# EAGLE design pwr_supply_controller (EAGLE 7.2.0)
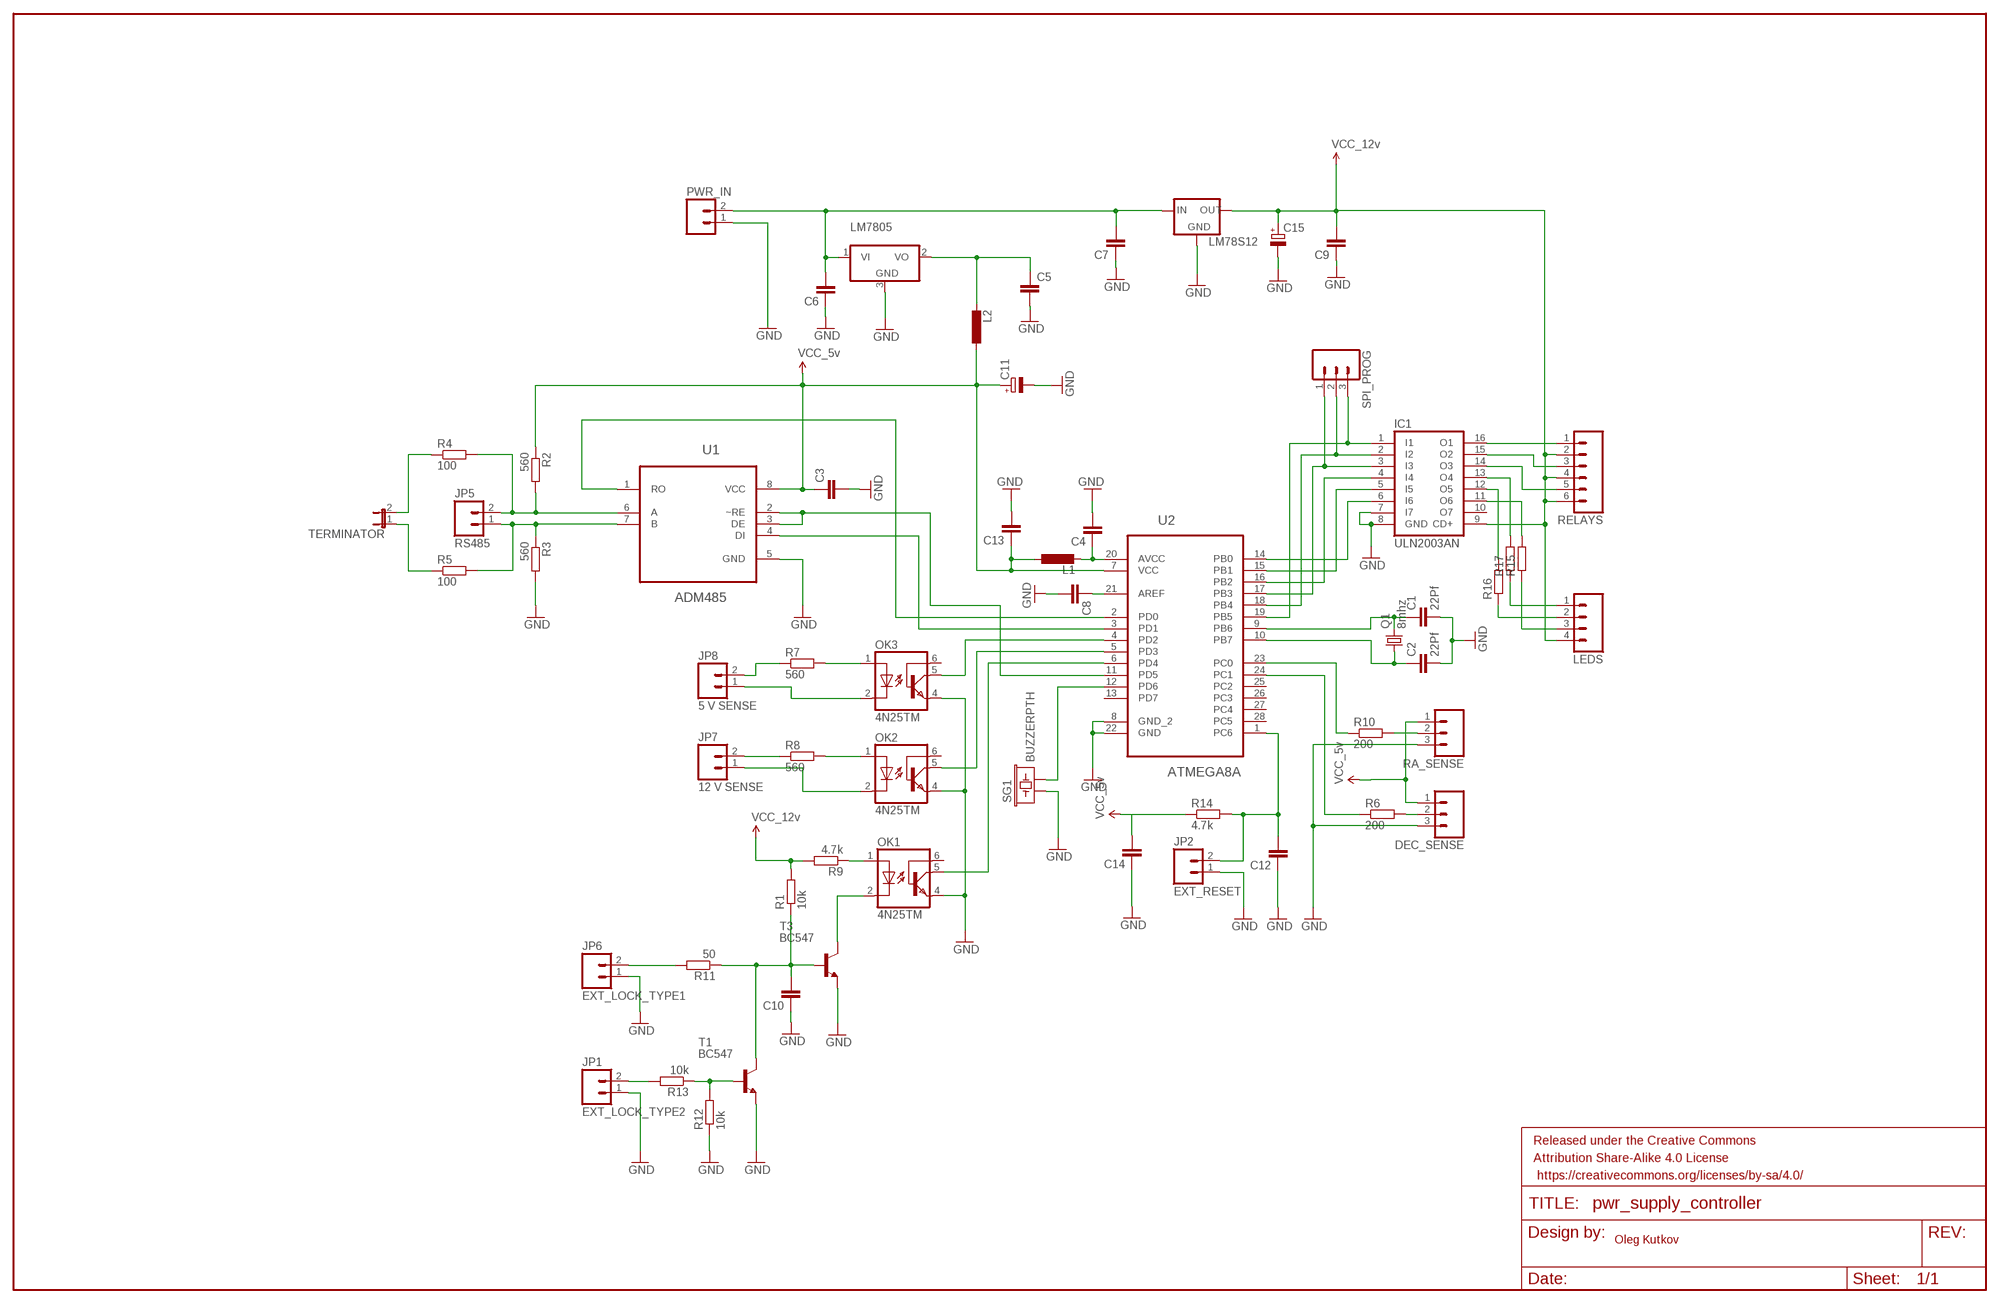
[diagram p0: schematic, sheet 1]

## Parts
C1  22Pf  C-EUC0603K  [C0603K]
C2  22Pf  C-EUC0603K  [C0603K]
C3  C-EUC0603K  [C0603K]
C4  C-EUC0603K  [C0603K]
C5  C-EUC0603K  [C0603K]
C6  C-EUC0805  [C0805]
C7  C-EUC0805  [C0805]
C8  C-EUC0603K  [C0603K]
C9  C-EUC0805  [C0805]
C10  C-EUC0603K  [C0603K]
C11  CPOL-EUE2-5  [E2-5]
C12  C-EUC0603K  [C0603K]
C13  C-EUC0603K  [C0603K]
C14  C-EUC0603K  [C0603K]
C15  CPOL-EUE3.5-8  [E3,5-8]
DEC_SENSE  M03PTH  [1X03]
FRAME1  FRAME-LEDGER  [CREATIVE_COMMONS]
IC1  ULN2003AN  [DIL16]
JP1  EXT_LOCK_TYPE2  M02JST-PTH-VERT  [JST-2-PTH-VERT]
JP2  EXT_RESET  M02PTH  [1X02]
JP5  RS485  M02JST-PTH-VERT  [JST-2-PTH-VERT]
JP6  EXT_LOCK_TYPE1  M02JST-PTH-VERT  [JST-2-PTH-VERT]
JP7  12 V SENSE  M02JST-PTH-VERT  [JST-2-PTH-VERT]
JP8  5 V SENSE  M02JST-PTH-VERT  [JST-2-PTH-VERT]
L1  L-EU0204/7  [0204/7]
L2  L-EU0204/7  [0204/7]
LEDS  M04PTH  [1X04]
LM78S12  V_REG_78XX-TO-220  [TO-220-ALT]
LM7805  7808DT  [TO252]
OK1  4N25TM  [DIL6-04]
OK2  4N25TM  [DIL6-04]
OK3  4N25TM  [DIL6-04]
PWR_IN  M02JST-PTH-VERT  [JST-2-PTH-VERT]
Q1  8mhz  CRYSTALHC49S  [HC49/S]
R1  10k  R-EU_0204/7  [0204/7]
R2  560  R-EU_M0805  [M0805]
R3  560  R-EU_M0805  [M0805]
R4  100  R-EU_R0805  [R0805]
R5  100  R-EU_M0805  [M0805]
R6  200  R-EU_M0805  [M0805]
R7  560  R-EU_0204/7  [0204/7]
R8  560  R-EU_0204/7  [0204/7]
R9  4.7k  R-EU_0204/7  [0204/7]
R10  200  R-EU_M0805  [M0805]
R11  50  R-EU_0204/7  [0204/7]
R12  10k  R-EU_0204/7  [0204/7]
R13  10k  R-EU_0204/7  [0204/7]
R14  4.7k  R-EU_M0805  [M0805]
R15  R-EU_M0805  [M0805]
R16  R-EU_M0805  [M0805]
R17  R-EU_M0805  [M0805]
RA_SENSE  M03PTH  [1X03]
RELAYS  M06POLAR  [MOLEX-1X6]
SG1  BUZZERPTH  [BUZZER-12MM]
SPI_PROG  M03PTH  [1X03]
T1  BC547  [TO92]
T3  BC547  [TO92]
TERMINATOR  JUMPER-2PTH_LOCK  [1X02_LOCK]
U1  ADM485  MAX487ECSA+  [SOIC127P600X175-8N]
U2  ATMEGA8A  ATMEGA48A-PU  [DIP254P762X457-28]

## Nets
GND: C1.2 C2.2 C3.2 C4.2 C5.2 C6.1 C7.1 C8.2 C9.1 C10.1 C11.- C12.1 C13.2 C14.1 C15.- DEC_SENSE.3 IC1.7(I7) IC1.8(GND) JP1.1 JP2.1 JP6.1 LM78S12.GND LM7805.3(GND) OK1.4(EMI) OK2.4(EMI) OK3.4(EMI) PWR_IN.1 R3.2 R12.1 RA_SENSE.3 SG1.+ T1.1(E) T3.1(E) U1.5(GND) U2.8(GND_2) U2.22(GND)
N$1: C1.1 Q1.2 U2.9(PB6)
N$2: C2.1 Q1.1 U2.10(PB7)
N$3: OK3.5(COL) U2.4(PD2)
N$4: OK2.5(COL) U2.5(PD3)
N$5: OK3.1(A) R7.2
N$6: OK1.5(COL) U2.6(PD4)
N$7: C4.1 L1.2 U2.20(AVCC)
N$8: R10.2 RA_SENSE.2
N$9: U1.1(RO) U2.2(PD0)
N$10: C8.1 U2.21(AREF)
N$11: U1.4(DI) U2.3(PD1)
N$12: U1.2(~RE) U1.3(DE) U2.11(PD5)
N$13: JP5.2 R2.2 R4.2 U1.6(A)
N$14: JP5.1 R3.1 R5.2 U1.7(B)
N$15: R4.1 TERMINATOR.2
N$16: R5.1 TERMINATOR.1
N$17: C6.2 C7.2 LM78S12.IN LM7805.1(VI) PWR_IN.2
N$18: DEC_SENSE.2 R6.2
N$19: IC1.6(I6) U2.14(PB0)
N$20: IC1.5(I5) U2.15(PB1)
N$21: IC1.4(I4) U2.16(PB2)
N$22: IC1.3(I3) SPI_PROG.1 U2.17(PB3)
N$23: IC1.2(I2) SPI_PROG.2 U2.18(PB4)
N$24: IC1.1(I1) SPI_PROG.3 U2.19(PB5)
N$25: R10.1 U2.23(PC0)
N$26: R6.1 U2.24(PC1)
N$27: IC1.16(O1) RELAYS.1
N$28: IC1.15(O2) RELAYS.3
N$29: IC1.14(O3) RELAYS.5
N$30: JP6.2 R11.2
N$31: LEDS.1 R17.1
N$32: LEDS.2 R16.1
N$33: IC1.11(O6) R15.2
N$34: SG1.- U2.12(PD6)
N$35: JP8.2 R7.1
N$36: JP8.1 OK3.2(C)
N$37: OK2.1(A) R8.2
N$38: JP7.2 R8.1
N$39: JP7.1 OK2.2(C)
N$40: C10.2 R1.1 R11.1 T1.3(C) T3.2(B)
N$41: R12.2 R13.1 T1.2(B)
N$42: OK1.1(A) R9.1
N$43: C5.1 L2.2 LM7805.2(VO)
N$44: OK1.2(C) T3.3(C)
N$45: JP1.2 R13.2
N$46: C12.2 JP2.2 R14.2 U2.1(PC6)
N$47: IC1.12(O5) R16.2
N$49: IC1.13(O4) R17.2
N$50: LEDS.3 R15.1
VCC: C3.1 C11.+ C13.1 C14.2 DEC_SENSE.1 L1.1 L2.1 R2.1 R14.1 RA_SENSE.1 U1.8(VCC) U2.7(VCC) ; supply symbol labelled VCC_5v
VDD: C9.2 C15.+ IC1.9(CD+) LEDS.4 LM78S12.OUT R1.2 R9.2 RELAYS.2 RELAYS.4 RELAYS.6 ; supply symbol labelled VCC_12v
Unconnected: IC1.10(O7) OK1.6(BAS) OK2.6(BAS) OK3.6(BAS) U2.13(PD7) U2.25(PC2) U2.26(PC3) U2.27(PC4) U2.28(PC5)

## Notes on the sheet
- Oleg Kutkov

## Library data of the parts
C1-C10 C12-C14 = rcl:C-EU: CAPACITOR, European symbol
C11 C15 = resistor:CPOL-EU: POLARIZED CAPACITOR, European symbol
DEC_SENSE RA_SENSE SPI_PROG = SparkFun-Connectors:M03: Header 3 Standard 3-pin 0.1" header. Use with straight break away headers (SKU : PRT-00116), right angle break away headers (PRT-00553), swiss pins (PRT-00743), machine pins (PRT-00117), and female headers (PRT-00115). Molex polarized connector foot print use with SKU : PRT-08232 with associated crimp pins and housings.
FRAME1 = SparkFun-Aesthetics:FRAME-LEDGER: Schematic Frame Standard 11x14 US Ledger frame
IC1 = uln-udn:ULN2003A: DRIVER ARRAY
JP1 JP2 JP5-JP8 PWR_IN = SparkFun-Connectors:M02: Standard 2-pin 0.1" header. Use with - straight break away headers ( PRT-00116) - right angle break away headers (PRT-00553) - swiss pins (PRT-00743) - machine pins (PRT-00117) - female headers (PRT-00115) Molex polarized connector foot print use with: PRT-08233 with associated crimp pins and housings. 2.54_SCREWTERM for use with PRT-10571. 3.5mm Screw Terminal footprints for PRT-08084 5mm Screw Terminal footprints for use with PRT-08433
L1 L2 = rcl:L-EU: INDUCTOR, European symbol
LEDS = SparkFun-Connectors:M04: Header 4 Standard 4-pin 0.1" header. Use with straight break away headers (SKU : PRT-00116), right angle break away headers (PRT-00553), swiss pins (PRT-00743), machine pins (PRT-00117), and female headers (PRT-00115). Molex polarized connector foot print use with SKU : PRT-08231 with associated crimp pins and housings. 1MM SMD Version SKU: PRT-10208
LM78S12 = SparkFun-PowerIC:V_REG_78XX: Voltage Regulator Standard 7805 5V regulator. IGO (Input Ground Output). Spark Fun Electronics SKU : COM-00107
LM7805 = linear:78*: Positive VOLTAGE REGULATOR Source: http://cache.national.com/ds/LM/LM78L05.pdf http://www.fairchildsemi.com/ds/LM/LM7805.pdf
OK1-OK3 = optocoupler:4N*?M: General Purpose 6-Pin Phototransistor Optocouplers Source: http://www.fairchildsemi.com/ds/4N/4N35-M.pdf; OC_FARNELL: unknown; OC_NEWARK: unknown
Q1 = adafruit:CRYSTAL: CRYSTAL; OC_FARNELL: 1667008; OC_NEWARK: unknown
R1-R14 = resistor:R-EU_: RESISTOR, European symbol
R15-R17 = rcl:R-EU_: RESISTOR, European symbol
RELAYS = SparkFun-Connectors:M06: Header 6 Standard 6-pin 0.1" header. Use with straight break away headers (SKU : PRT-00116), right angle break away headers (PRT-00553), swiss pins (PRT-00743), machine pins (PRT-00117), and female headers (PRT-00115). Molex polarized connector foot print use with SKU : PRT-08094 with associated crimp pins and housings. NOTES ON THE VARIANTS LOCK and LOCK_LONGPADS... This footprint was designed to help hold the alignment of a through-hole component (i.e. 6-pin header) while soldering it into place. You may notice that each hole has been shifted either up or down by 0.005 of an inch from it's more standard position (which is a perfectly straight line). This slight alteration caused the pins (the squares in the middle) to touch the edges of the holes. Because they are alternating, it causes a "brace" to hold the component in place. 0.005 has proven to be the perfect amount of "off-center" position when using our standard breakaway headers. Although looks a little odd when you look at the bare footprint, once you have a header in there, the alteration is very hard to notice. Also,if you push a header all the way into place, it is covered up entirely on the bottom side. This idea of altering the position of holes to aid alignment will be further integrated into the Sparkfun Library for other footprints. It can help hold any component with 3 or more connection pins.
SG1 = SparkFun-Electromechanical:BUZZER: Buzzer 12mm Spark Fun Electronics SKU : Comp-Buzzer
T1 T3 = transistor:BC547: NPN TRANSISTOR
TERMINATOR = SparkFun-Passives:JUMPER-2: Jumper Basic 0.1" spaced jumper. Use with breakaway headers.
U1 = Maxim_By_element14_Batch_1:MAX487ECSA+: Low-Power, Slew-Rate-Limited RS-485/RS-422 Transceivers; MPN: MAX487ECSA+; OC_FARNELL: 9724532; OC_NEWARK: 68K4803; PACKAGE: SOIC-8; SUPPLIER: Maxim
U2 = Atmel_By_element14_Batch_1-00:ATMEGA48A-PU: MCU; DESCRIPTION: MCU; MPN: ATMEGA48A-PU; OC_FARNELL: 1841613; OC_NEWARK: 12T1302; PACKAGE: DIP-28; SUPPLIER: Atmel

## Board
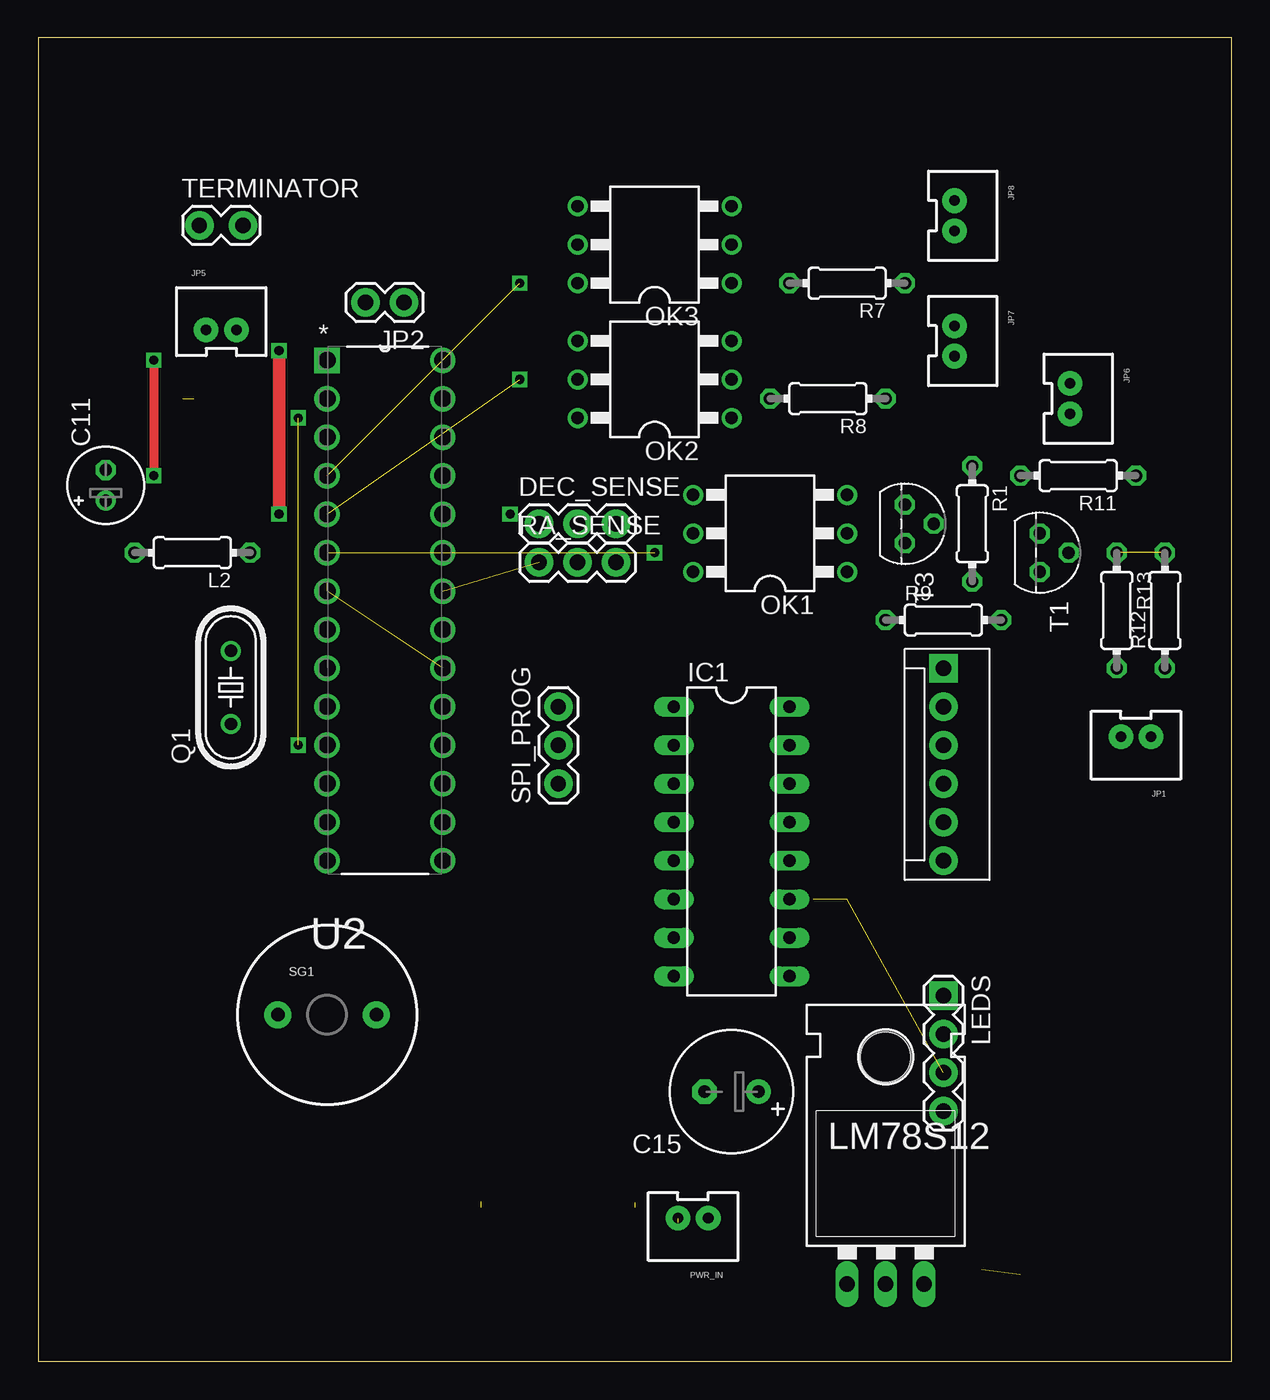
[diagram p1: board, top side]
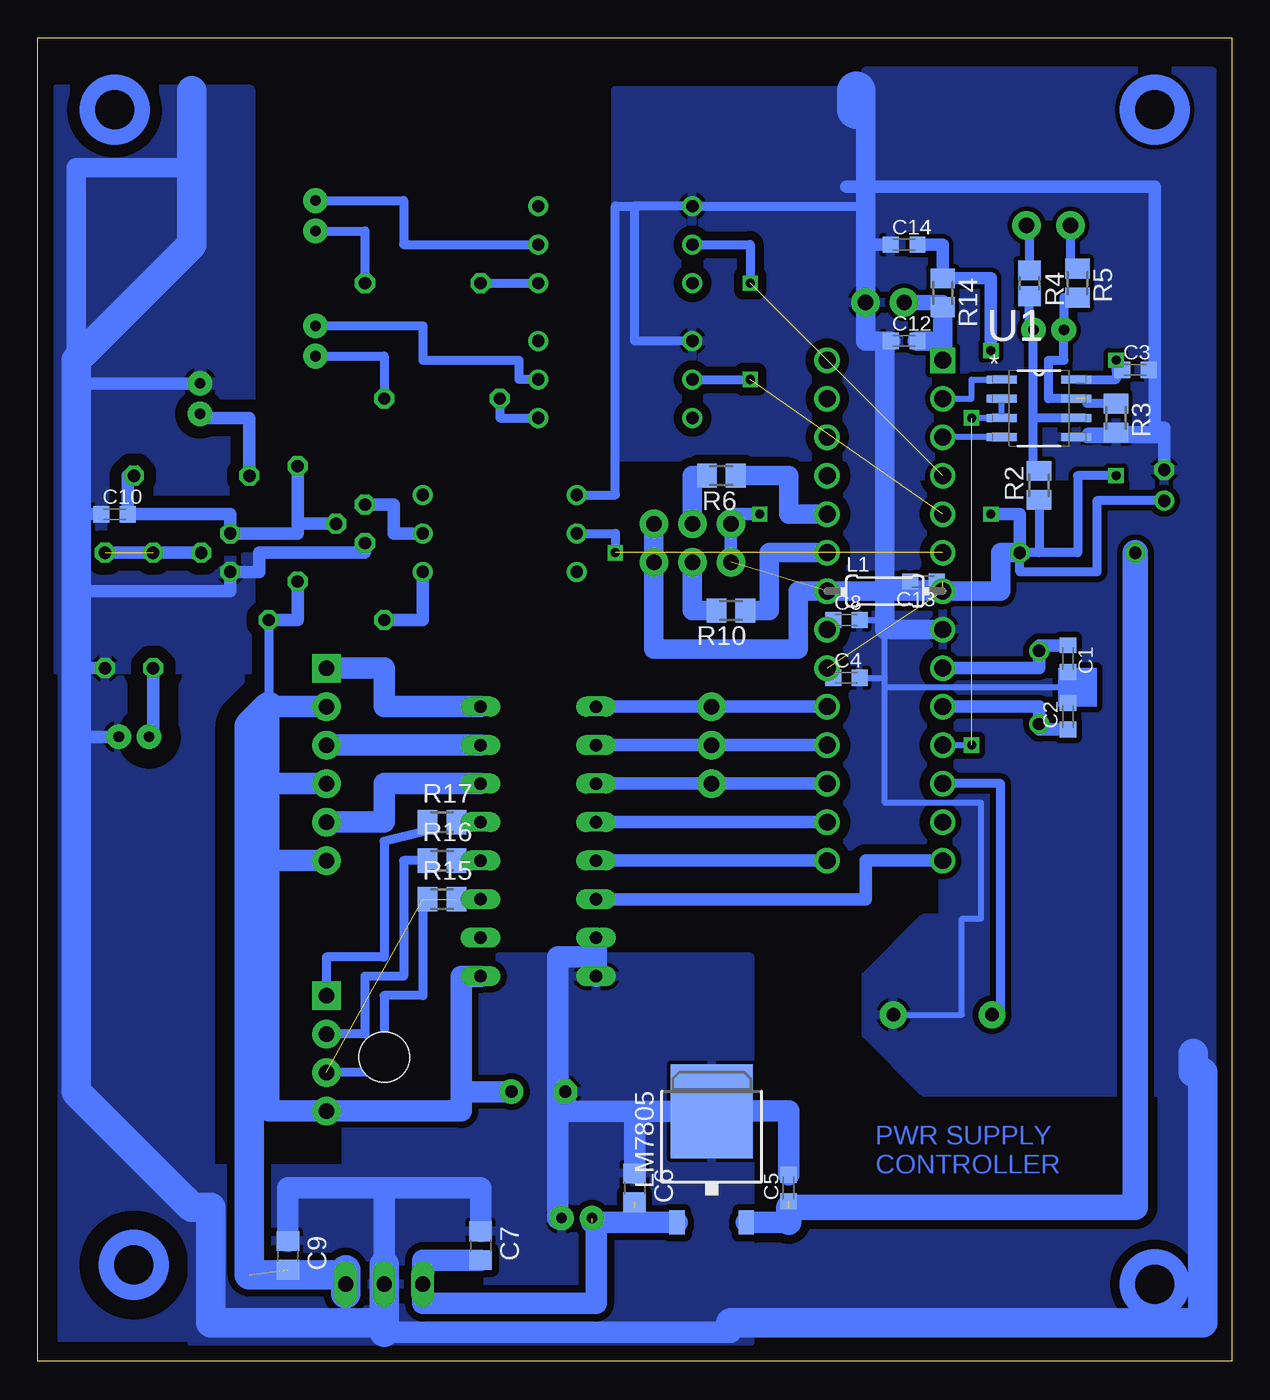
[diagram p2: board, bottom side, seen from below]

Size 78.72 x 87.3 mm. Coordinates in mm from the lower left corner, seen from the top.
Outline: 0,0 78.72,0 78.72,87.3 0,87.3 0,0
Copper layers (1*16): Top 0.035mm / dielectric 1.5mm / Bottom 0.035mm
Design rules "default": minimum track width 10mil, minimum drill 24mil, track to track 8mil, track to pad 8mil, pad to pad 8mil, via to via 8mil, smd to smd 8mil, copper to edge 40mil, drill to drill 8mil, minimum pad ring 10mil, minimum via ring 8mil, stop-mask expansion 4mil, vias tented up to drill 0mil, thermal gap 10mil

### Footprints (pad centres in the part's own frame; a part is rotated, then mirrored left to right if it is on the bottom)
C0603K = smd 1.05 x 1.08: 1 -0.875,0; 2 0.875,0
C0805 = smd 1.3 x 1.5: 1 -0.95,0; 2 0.95,0
E2-5 = drill 0.813 pad 1.27: + -1.016,0 | drill 0.813 pad 1.27 octagon: - 1.016,0
E3,5-8 = drill 0.813 pad 1.6: + -1.778,0 | drill 0.813 pad 1.6 octagon: - 1.778,0
1X03 = drill 1.016 pad 1.88: 1 0,0; 2 2.54,0; 3 5.08,0
DIL16 = drill 0.813 long: 1 -8.89,-3.81; 2 -6.35,-3.81; 3 -3.81,-3.81; 4 -1.27,-3.81; 5 1.27,-3.81; 6 3.81,-3.81; 7 6.35,-3.81; 8 8.89,-3.81; 9 8.89,3.81; 10 6.35,3.81; 11 3.81,3.81; 12 1.27,3.81; 13 -1.27,3.81; 14 -3.81,3.81; 15 -6.35,3.81; 16 -8.89,3.81
JST-2-PTH-VERT = drill 0.7 pad 1.626: 1 -1,-0.55; 2 1,-0.55
1X02 = drill 1.016 pad 1.88: 1 0,0; 2 2.54,0
0204/7 = drill 0.813 octagon: 1 -3.81,0; 2 3.81,0
1X04 = drill 1.016 pad 1.88 square: 1 0,0 | drill 1.016 pad 1.88: 2 2.54,0; 3 5.08,0; 4 7.62,0
TO-220-ALT = drill 1.016 long: GND 0,-3.81; IN -2.54,-3.81; OUT 2.54,-3.81 | hole 3.302: 0,11.176
TO252 = smd 1 x 1.6: 1 -2.28,-4.8; 2 2.28,-4.8 | smd 5.4 x 6.2: 3 0,2.5
DIL6-04 = drill 0.813: 1 -2.54,-5.08; 2 0,-5.08; 3 2.54,-5.08; 4 2.54,5.08; 5 0,5.08; 6 -2.54,5.08
HC49/S = drill 0.813: 1 -2.413,0; 2 2.413,0
M0805 = smd 1.3 x 1.6: 1 -0.95,0; 2 0.95,0
R0805 = smd 1.3 x 1.5: 1 -0.85,0; 2 0.85,0
MOLEX-1X6 = drill 1.016 pad 1.88 square: 1 0,0 | drill 1.016 pad 1.88: 2 2.54,0; 3 5.08,0; 4 7.62,0; 5 10.16,0; 6 12.7,0
BUZZER-12MM = drill 0.9 pad 1.778: + 3.25,0; - -3.25,0
TO92 = drill 0.813 octagon: 1 1.27,0; 2 0,1.905; 3 -1.27,0
1X02_LOCK = drill 1.016 pad 1.88: 1 -0.178,0; 2 2.718,0
SOIC127P600X175-8N = smd 1.981 x 0.533: 1 -2.464,1.905; 2 -2.464,0.635; 3 -2.464,-0.635; 4 -2.464,-1.905; 5 2.464,-1.905; 6 2.464,-0.635; 7 2.464,0.635; 8 2.464,1.905
DIP254P762X457-28 = drill 1.118 square: 1 -7.62,33.02 | drill 1.118: 2 -7.62,30.48; 3 -7.62,27.94; 4 -7.62,25.4; 5 -7.62,22.86; 6 -7.62,20.32; 7 -7.62,17.78; 8 -7.62,15.24; 9 -7.62,12.7; 10 -7.62,10.16; 11 -7.62,7.62; 12 -7.62,5.08; 13 -7.62,2.54; 14 -7.62,0; 15 0,0; 16 0,2.54; 17 0,5.08; 18 0,7.62; 19 0,10.16; 20 0,12.7; 21 0,15.24; 22 0,17.78; 23 0,20.32; 24 0,22.86; 25 0,25.4; 26 0,27.94; 27 0,30.48; 28 0,33.02

### Placement (x,y rotation side)
C1  10.8,46.36 270 bottom
C2  10.8,42.55 90 bottom
C3  6.35,65.41 0 bottom
C4  25.4,45.09 0 bottom
C5  29.21,11.43 90 bottom
C6  39.37,11.43 270 bottom
C7  49.53,7.62 270 bottom
C8  25.4,48.9 0 bottom
C9  62.23,6.98 270 bottom
C10  73.66,55.88 0 bottom
C11  4.44,57.79 90 top
C12  21.59,67.31 0 bottom
C13  20.32,51.44 180 bottom
C14  21.59,73.66 0 bottom
C15  45.72,17.78 180 top
DEC_SENSE  33.02,55.25 0 top
FRAME1  21.59,-7.62 0 top  (outside the outline)
IC1  45.72,34.29 270 top
JP1  72.39,40.64 180 top
JP2  24.13,69.85 180 top
JP5  12.06,68.58 0 top
JP6  68.58,63.5 270 top
JP7  60.96,67.31 270 top
JP8  60.96,75.56 270 top
L1  22.86,50.8 0 bottom
L2  10.16,53.34 180 top
LEDS  59.69,24.13 270 top
LM78S12  55.88,8.89 0 top
LM7805  34.29,13.97 0 bottom
OK1  48.26,54.61 90 top
OK2  40.64,64.77 90 top
OK3  40.64,73.66 90 top
PWR_IN  43.18,8.89 180 top
Q1  12.7,44.45 90 top
R1  61.59,55.25 270 top
R2  12.7,57.79 90 bottom
R3  7.62,62.23 270 bottom
R4  13.34,71.12 270 bottom
R5  10.16,71.12 270 bottom
R6  33.66,58.42 180 bottom
R7  53.34,71.12 180 top
R8  52.07,63.5 180 top
R9  59.69,48.9 0 top
R10  33.02,49.53 180 bottom
R11  68.58,58.42 180 top
R12  74.3,49.53 90 top
R13  71.12,49.53 270 top
R14  19.05,70.48 270 bottom
R15  52.07,30.48 0 bottom
R16  52.07,33.02 0 bottom
R17  52.07,35.56 0 bottom
RA_SENSE  33.02,52.7 0 top
RELAYS  59.69,45.72 270 top
SG1  19.05,22.86 0 top
SPI_PROG  34.29,38.1 90 top
T1  66.04,53.34 270 top
T3  57.15,55.25 270 top
TERMINATOR  10.8,74.93 0 top
U1  12.7,62.86 0 bottom
U2  26.67,33.02 0 top

### Tracks (layer width: path | path; a pad name or v marks a point on that pad's centre or on a via)
GND
  Bottom 0.406: 10.8,44.45 22.86,44.45 | 22.86,44.45 22.86,45.09 | C8.2 22.86,48.9 22.86,48.26 22.86,45.09 | 22.86,44.45 22.86,36.83 16.51,36.83 16.51,29.21 17.78,29.21 17.78,22.86 SG1.+ | C4.2 22.86,45.09 | C13.2 22.86,51.44 22.86,52.07
  Bottom 0.61: R3.2 9.52,61.28 9.52,60.96 | 39.37,76.2 OK3.4 24.13,76.2 | OK2.4 39.37,67.31 39.37,76.2 | OK1.4 40.64,57.15 40.64,76.2 39.37,76.2 | C3.2 5.08,65.41 5.08,66.04
  Bottom 0.813: C2.2 10.8,44.45 C1.2 | C10.1 76.2,55.88 | JP6.1 76.2,64.5 76.2,64.77 | R12.1 76.2,45.72 | 76.2,45.72 76.2,48.26 | T3.1 57.15,53.34 64.14,53.34 64.14,52.07 T1.1 66.04,50.8 76.2,50.8 | R3.2 4.44,61.28 | 4.44,61.28 4.44,60.96 | 4.44,60.96 C11.- | 9.52,60.96 4.44,60.96 | 4.44,61.28 4.44,61.59 5.08,61.59 5.08,66.04 5.08,77.47 25.4,77.47 | JP1.1 76.2,41.19 76.2,45.72 | C14.1 24.13,73.66
  Bottom 1.016: JP2.1 24.13,67.31
  Bottom 1.27: U2.8 22.86,48.26 22.86,50.8 | 22.86,50.8 U2.22 28.57,50.8 28.57,46.99 38.1,46.99 RA_SENSE.3 DEC_SENSE.3 | 22.86,50.8 22.86,52.07 22.86,67.31 C12.1 24.13,67.31 24.13,73.66 24.13,76.2 24.13,83.82 | 68.58,83.82 68.58,78.74 76.2,78.74 76.2,66.04 76.2,64.77 76.2,55.88 76.2,50.8 76.2,48.26
  Bottom 1.422: IC1.7 41.91,26.67 | 41.91,26.67 IC1.8 | 44.45,17.78 C15.- 43.94,16.47 39.37,16.47 | 44.45,17.78 44.45,26.67 41.91,26.67 | LM7805.3 35.56,16.47 | 35.56,16.47 39.37,16.47 | C6.1 39.37,16.47 | C5.2 29.21,16.51 35.56,16.51 35.56,16.47 | C7.1 49.53,9.44 49.53,11.43 55.88,11.43 | LM78S12.GND 55.88,6.35 55.88,11.43 | 55.88,11.43 62.23,11.43 C9.1 | 44.45,9.44 44.45,17.78 | 55.88,1.91 33.02,1.91 33.02,2.54
  Bottom 1.93: 68.58,83.82 68.58,73.66 76.2,66.04 76.2,17.78 68.58,10.16 67.31,10.16 67.31,2.54 55.88,2.54 | 55.88,6.35 55.88,2.54 | 55.88,2.54 55.88,1.91 | 33.02,2.54 1.9,2.54 1.9,19.05 2.54,19.05 2.54,20.32
  Bottom 2.54: 24.77,83.82 24.77,82.55
  pour Bottom (isolate 0.686): 19.05,66.04 26.67,66.04 26.67,33.02 19.05,33.02 19.05,64.77
  pour Bottom (isolate 0.584): 24.13,83.82 40.64,83.82 40.64,59.69 24.13,59.69 24.13,60.96 24.13,82.55
  pour Bottom (isolate 0.813): 64.77,83.82 77.47,83.82 77.47,45.72 64.77,45.72 64.77,81.28
  pour Bottom (isolate 0.305): 1.27,85.09 24.13,85.09 24.13,58.42 1.27,58.42 1.27,83.82
  pour Bottom (isolate 1.27): 64.77,48.26 77.47,48.26 77.47,1.27 64.77,1.27 64.77,46.99
  pour Bottom (isolate 0.381): 1.27,58.42 19.05,58.42 19.05,17.78 1.27,17.78
  pour Bottom (isolate 0.406): 31.75,26.67 58.42,26.67 58.42,8.89 31.75,8.89 31.75,25.4
  pour Bottom (isolate 0.483): 31.75,12.7 68.58,12.7 68.58,1.27 31.75,1.27 31.75,11.43
  pour Bottom: 19.05,29.21 20.32,29.21 24.13,25.4 24.13,21.59 20.32,17.78 19.05,17.78 19.05,27.94
  pour Bottom (isolate 0.61): 2.54,17.78 6.35,17.78 6.35,10.16 34.29,10.16 34.29,2.54 2.54,2.54 2.54,15.24
N$1
  Bottom 0.813: U2.9 12.7,45.72 Q1.2 12.7,47.23 C1.1
N$2
  Bottom 0.813: U2.10 12.7,43.18 Q1.1 12.7,41.67 C2.1
N$3  (via drill 0.6)  (1 unrouted)
  Bottom 0.61: OK3.5 31.75,73.66 v31.75,71.12
N$4  (1 unrouted)
  Bottom 0.61: OK2.5 31.75,64.77
N$5
  Bottom 0.61: R7.2 OK3.1
N$6  (1 unrouted)
  Bottom 0.61: OK1.5 40.64,54.61 40.64,53.34
N$7  (1 unrouted)
  Bottom 0.406: C4.1 26.67,45.09 U2.20
N$8
  Bottom 1.27: RA_SENSE.2 35.56,49.53 R10.2
N$9
  Bottom 0.406: U2.2 17.14,63.5 17.14,64.77 U1.1
N$10
  Bottom 0.406: C8.1 26.67,48.9 U2.21
N$11
  Bottom 0.406: U1.4 U2.3
N$12  (via drill 0.6)  (1 unrouted)
  Bottom 0.406: U1.2 U1.3 17.14,62.23 | U2.11 v17.14,40.64
N$13
  Bottom 0.61: R4.2 13.34,68.03 JP5.2 13.06,62.23 | U1.6 13.06,62.23 | R2.2 13.06,58.73 13.06,62.23
N$14  (1 unrouted)
  Bottom 0.61: R5.2 11.06,70.17 JP5.1 11.06,66.04 12.06,66.04 12.06,63.5 U1.7 | R3.1 9.52,63.18 9.52,63.5
N$15
  Bottom 0.61: TERMINATOR.2 13.34,74.93 R4.1
N$16
  Bottom 0.61: R5.1 10.62,72.07 TERMINATOR.1
N$17  (2 unrouted)
  Bottom 1.422: LM7805.1 39.37,9.17 | 39.37,9.17 39.37,10.16 | C7.2 53.34,6.67 LM78S12.IN 53.34,3.81 41.91,3.81 41.91,9.17 | 39.37,9.17 41.91,9.17 | 42.18,9.17 41.91,9.17
N$18
  Bottom 1.27: DEC_SENSE.2 35.56,58.42 R6.2
N$19
  Bottom 0.813: IC1.6 24.13,30.48 24.13,33.02 U2.14
N$20
  Bottom 0.813: IC1.5 U2.15
N$21
  Bottom 0.813: IC1.4 U2.16
N$22
  Bottom 0.813: IC1.3 SPI_PROG.1 U2.17
N$23
  Bottom 0.813: IC1.2 SPI_PROG.2 U2.18
N$24
  Bottom 0.813: IC1.1 SPI_PROG.3 U2.19
N$25
  Bottom 1.27: U2.23 30.48,53.34 30.48,49.53 R10.1
N$26
  Bottom 1.27: U2.24 29.21,55.88 29.21,58.42 R6.1
N$27
  Bottom 1.422: RELAYS.1 55.88,45.72 55.88,43.18 IC1.16
N$28
  Bottom 1.422: IC1.15 RELAYS.3
N$29
  Bottom 1.422: RELAYS.5 55.88,35.56 55.88,38.1 IC1.14
N$30
  Bottom 0.813: R11.2 64.77,62.23 68.03,62.23 JP6.2
N$31
  Bottom 0.61: LEDS.1 59.69,26.67 55.88,26.67 55.88,34.29 53.34,34.93 53.34,35.56 R17.1
N$32
  Bottom 0.61: LEDS.2 57.15,21.59 57.15,25.4 54.61,25.4 54.61,33.02 R16.1
N$33  (1 unrouted)
  Bottom 0.61: 53.34,30.48 53.34,24.13 55.88,24.13 55.88,19.05 59.69,19.05 | IC1.11 R15.2
N$34
  Bottom 0.61: U2.12 15.24,38.1 15.24,22.86 SG1.-
N$35
  Bottom 0.61: JP8.2 57.15,74.56 R7.1
N$36
  Bottom 0.61: JP8.1 54.61,76.56 54.61,73.66 OK3.2
N$37
  Bottom 0.61: R8.2 48.26,62.23 OK2.1
N$38
  Bottom 0.61: JP7.2 55.88,66.31 R8.1
N$39
  Bottom 0.61: OK2.2 46.99,64.77 46.99,66.04 53.34,66.04 53.34,68.31 JP7.1
N$40
  Bottom 0.406: C10.2 72.39,55.88
  Bottom 0.813: T3.2 61.59,55.25 | 61.59,55.25 R1.1 | 61.59,55.25 61.59,54.61 T1.3 66.04,55.88 72.39,55.88 | R11.1 72.78,58.42 C10.2
N$41  (1 unrouted)
  Bottom 0.813: T1.2 R12.2
N$42
  Bottom 0.813: OK1.1 53.34,48.9 R9.1
N$43  (1 unrouted)
  Bottom 1.422: LM7805.2 29.21,9.17
  Bottom 1.676: L2.2 6.35,10.16 29.21,10.16 29.21,9.17
N$44
  Bottom 0.813: OK1.2 55.25,54.61 55.25,56.52 T3.3
N$45
  Bottom 0.813: JP1.2 71.12,41.19 R13.2
N$46
  Bottom 1.016: JP2.2 19.05,69.85 19.05,68.58
  Bottom 1.27: R14.2 19.05,68.58 19.05,67.31 | 19.05,67.31 U2.1 | C12.2 19.05,67.31
N$47
  Bottom 0.61: R16.2 IC1.12
N$48  (via drill 0.6)
  other vias: 31.75,64.77
N$49
  Bottom 0.61: R17.2 IC1.13
N$50  (1 unrouted)
  Bottom 0.61: R15.1 53.34,30.48
N$51  (via drill 0.6)
  other vias: 40.64,53.34
N$52  (via drill 0.6)
  other vias: 17.14,62.23
N$53  (via drill 0.6)
  other vias: 31.11,55.88
VCC  (via drill 0.6)  (2 unrouted)
  Top 0.61: v7.62,66.04 v7.62,58.42
  Top 0.813: v15.88,66.67 v15.88,55.88
  Bottom 0.406: C13.1 19.05,51.44 L1.1
  Bottom 0.61: U1.8 7.62,64.77 7.62,65.41 | 7.62,65.41 v7.62,66.04 | R2.1 12.7,53.34 L2.1 | v7.62,58.42 10.16,58.42 10.16,53.34 L2.1 | C11.+ 8.89,56.77 8.89,52.07 13.97,52.07 L2.1 | C3.1 7.62,65.41
  Bottom 0.813: v15.88,66.67 15.88,71.44 R14.1 19.05,73.66 C14.2 | v15.88,55.88 13.97,55.88 L2.1 | RA_SENSE.1 DEC_SENSE.1 33.02,55.88 31.75,55.88
  Bottom 1.27: L2.1 15.24,53.34 15.24,50.8 L1.1
VDD  (1 unrouted)
  Bottom 0.61: R9.2 63.5,43.18
  Bottom 0.813: R1.2 61.59,48.9 R9.2
  Bottom 1.422: IC1.9 50.8,25.4 50.8,17.78 | 50.8,17.78 50.8,16.51 LEDS.4 63.5,16.51 63.5,33.02 | RELAYS.6 63.5,33.02 | 63.5,33.02 63.5,38.1 | RELAYS.2 63.5,43.18 63.5,41.91 63.5,38.1 | RELAYS.4 63.5,38.1 | 58.42,5.71 LM78S12.OUT | C15.+ 50.8,17.78
  Bottom 1.93: 58.42,6.04 58.42,5.71 | 58.42,4.45 58.42,5.71 | 58.42,5.71 64.77,5.71 64.77,41.91 63.5,43.18
(copper drawn outside any net)
  shapes: Bottom area x1, Bottom circle x4

### Text on the board
Bottom: PWR SUPPLY / CONTROLLER